# Altium schematic sheet Blue Pill - Power.SchDoc
size A4
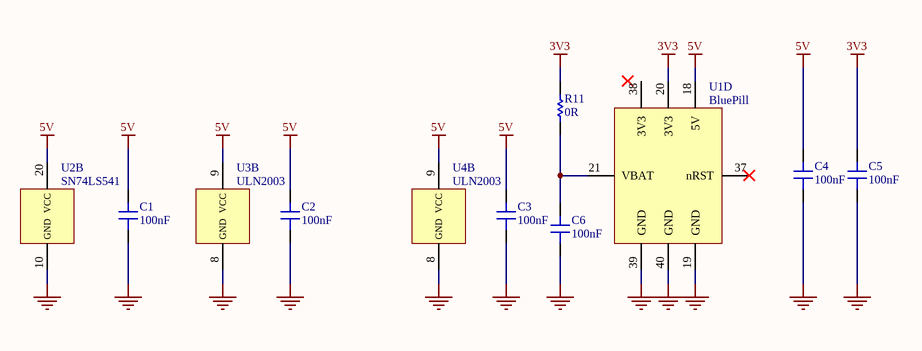
[diagram p0: Blue Pill - Power.SchDoc]

## Parts
C1  100nF  [0805]
C2  100nF  [0805]
C3  100nF  [0805]
C4  100nF  [0805]
C5  100nF  [0805]
C6  100nF  [0805]
R11  0R  [0805]
U1  BluePill  [Blue Pill]  (part D of 4)
U2  SN74LS541  [PDIP20]  (part B of 2)
U3  ULN2003  [PDIP16]  (part B of 2)
U4  ULN2003  [PDIP16]  (part B of 2)

## Nets
3V3: C5.1 R11.2 U1.20(3V3)
5V: C1.1 C2.1 C3.1 C4.1 U1.18(5V) U2.20(VCC) U3.9(VCC) U4.9(VCC)
GND: C1.2 C2.2 C3.2 C4.2 C5.2 C6.2 U1.19(GND) U1.39(GND) U1.40(GND) U2.10(GND) U3.8(GND) U4.8(GND)
NetC6_1: C6.1 R11.1 U1.21(VBAT)

Not connected (* = marked no-connect by the designer): U1 37(nRST)* 38(3V3)

## Library data of the parts
C1-C6 = Capacitor
R11 = Resistor
U1 = Blue Pill - Model 1: STM32 Blue Pill
U2 = SN74HC541 Type-2: Octal Buffers and Line Drivers With 3-State Outputs
U3 U4 = UN200x - Model 1: Seven Darlington arrays